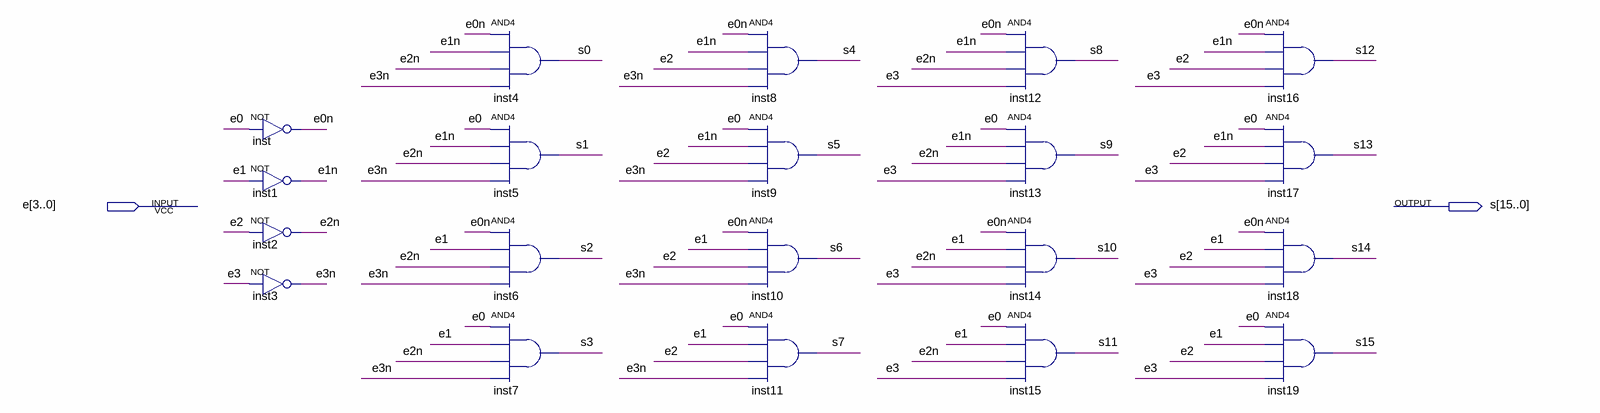
[diagram p0: schematic sheet]
// Quartus schematic ldm_decod_4x16.bdf as structural Verilog: 20 symbols, 2 pins
module ldm_decod_4x16 (
  input  [3:0] e,
  output [15:0] s
);

  wire e0n, e1n, e2n, e3n;

  not inst (e0n, e[0]);
  not inst1 (e1n, e[1]);
  not inst2 (e2n, e[2]);
  not inst3 (e3n, e[3]);
  and inst4 (s[0], e0n, e1n, e2n, e3n);
  and inst5 (s[1], e[0], e1n, e2n, e3n);
  and inst6 (s[2], e0n, e[1], e2n, e3n);
  and inst7 (s[3], e[0], e[1], e2n, e3n);
  and inst8 (s[4], e0n, e1n, e[2], e3n);
  and inst9 (s[5], e[0], e1n, e[2], e3n);
  and inst10 (s[6], e0n, e[1], e[2], e3n);
  and inst11 (s[7], e[0], e[1], e[2], e3n);
  and inst12 (s[8], e0n, e1n, e2n, e[3]);
  and inst13 (s[9], e[0], e1n, e2n, e[3]);
  and inst14 (s[10], e0n, e[1], e2n, e[3]);
  and inst15 (s[11], e[0], e[1], e2n, e[3]);
  and inst16 (s[12], e0n, e1n, e[2], e[3]);
  and inst17 (s[13], e[0], e1n, e[2], e[3]);
  and inst18 (s[14], e0n, e[1], e[2], e[3]);
  and inst19 (s[15], e[0], e[1], e[2], e[3]);
endmodule
